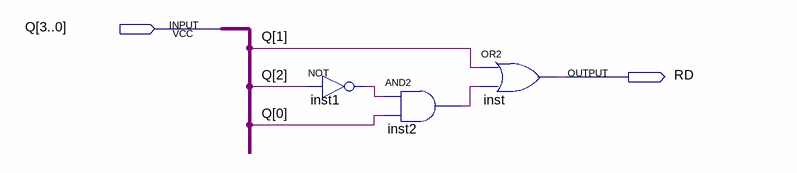
[diagram p0: schematic sheet]
// Quartus schematic RojoDerecha.bdf as structural Verilog: 3 symbols, 2 pins
module RojoDerecha (
  input  [3:0] Q,
  output RD
);

  wire inst1_out, inst2_out;

  not inst1 (inst1_out, Q[2]);
  and inst2 (inst2_out, inst1_out, Q[0]);
  or inst (RD, Q[1], inst2_out);
endmodule
